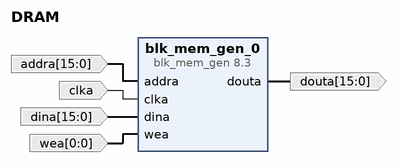
[diagram p0: block diagram of the top level]
# Vivado block design DRAM, xc7z010clg400-1, Vivado 2017.2
create_bd_design DRAM

create_bd_port -dir I -from 15 -to 0 addra
create_bd_port -dir I -type clk clka
create_bd_port -dir I -from 15 -to 0 dina
create_bd_port -dir O -from 15 -to 0 douta
create_bd_port -dir I -from 0 -to 0 wea

create_bd_cell -type ip -vlnv xilinx.com:ip:blk_mem_gen:8.3 blk_mem_gen_0
set_property -dict [list \
  CONFIG.Enable_32bit_Address false \
  CONFIG.Use_Byte_Write_Enable false \
  CONFIG.Write_Width_A 16 \
  CONFIG.Write_Depth_A 65536 \
  CONFIG.Read_Width_A 16 \
  CONFIG.Enable_A Always_Enabled \
  CONFIG.Register_PortA_Output_of_Memory_Primitives true \
  CONFIG.Load_Init_File true \
  CONFIG.Coe_File c:/Users/ASUS/Desktop/notebooks/Processor_Design_Resources/rom.coe \
  CONFIG.Use_RSTA_Pin false \
  CONFIG.use_bram_block Stand_Alone \
] [get_bd_cells blk_mem_gen_0]

# ---- connections ----

connect_bd_net [get_bd_ports addra] [get_bd_pins blk_mem_gen_0/addra]
connect_bd_net [get_bd_ports clka] [get_bd_pins blk_mem_gen_0/clka]
connect_bd_net [get_bd_ports dina] [get_bd_pins blk_mem_gen_0/dina]
connect_bd_net [get_bd_pins blk_mem_gen_0/douta] [get_bd_ports douta]
connect_bd_net [get_bd_ports wea] [get_bd_pins blk_mem_gen_0/wea]

validate_bd_design
save_bd_design
